# Altium schematic sheet [8]Halleffect.SchDoc
size B
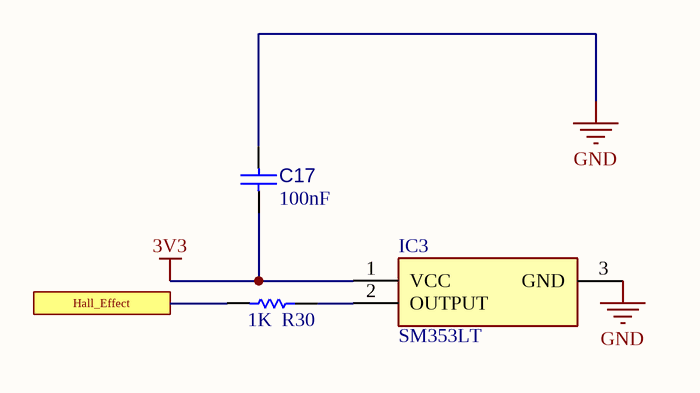
[diagram p0: [8]Halleffect.SchDoc]

## Parts
C17  value 100nF  [CAPC1608X90X40ML10T20]  (hidden comment: Capacitor 100 nF +/-10% 50 V 0603)
IC3  SM353LT  [SOT95P280X145-3N]
R30  1K  [RES 0603]

## Ports
Hall_Effect

## Nets
3V3: C17.1 IC3.1(VCC)
GND: C17.2 IC3.3(GND)
Hall_Effect: R30.2 ; port Hall_Effect
NetIC3_2: IC3.2(OUTPUT) R30.1

## Library data of the parts
C17 = CMP-001-00017-4: Chip Capacitor, 100 nF, +/- 10%, 50 V, 0603 (1608 Metric); Capacitor Type: Ceramic; Voltage Rating: 50V; RoHS Compliant: True; Max Operating Temperature: 125°C; Pins: 2; Mounting Technology: SM; Min Operating Temperature: -55°C; Tolerance: 10%; Case/Package: 0603
IC3 = SM353LT: Integrated Circuit; Manufacturer_Name: Honeywell; Datasheet Link: http://uk.rs-online.com/web/p/products/8252612; Height: 1.45mm; Manufacturer_Part_Number: SM353LT; Arrow Part Number: SM353LT; Arrow Price/Stock: https://www.arrow.com/en/products/sm353lt/honeywell; Mouser Part Number: 785-SM353LT; Mouser Price/Stock: https://www.mouser.co.uk/ProductDetail/Honeywell/SM353LT?qs=sJdZgDoFdSW3aINL1oUyuA%3D%3D; ComponentLink1Description: documentation; ComponentLink1URL: http://www.farnell.com/datasheets/2012450.pdf?_ga=2.245790722.741299232.1603476058-140605836.1598371586&_gac=1.141304070.1603476058.EAIaIQobChMItI734qXL7AIVmRatBh3JPwF_EAAYAiAAEgIk7PD_BwE
R30 = RES 3.3M 1% 0.1W [0603]: 1K 1% 0.1W [0603]; Value: 1M; Supplier 1: Digi-Key; Supplier Part Number 1: 541-3.30MHCT-ND; Tolerance: 1%